# Altium schematic sheet Communication.SchDoc
size A4; Organization: Memristor-Robotics; Address1: Vladimira Perića Valtera; Address2: Novi Sad, 21000; Address3: Serbia; SheetNumber: 7; SheetTotal: 11
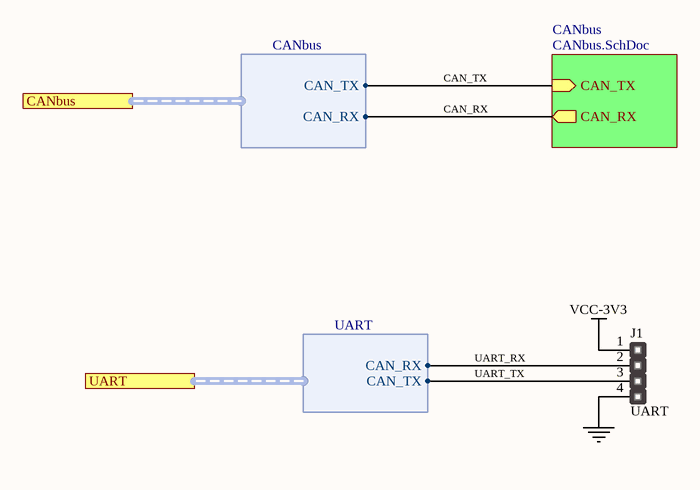
[diagram p0: Communication.SchDoc]

## Parts
J1  UART  [HM1X4]

## Sub-sheets
CANbus = CANbus.SchDoc: CAN_TX (in), CAN_RX (out)

## Ports
CANbus (harness CANbus), UART (harness UART)

## Harnesses
CANbus: CAN_TX, CAN_RX
UART: CAN_TX, CAN_RX

## Nets
GND: J1.4
VCC-3V3: J1.1
CAN_RX: sheet CANbus/CAN_RX, port CANbus.CAN_RX
CAN_TX: sheet CANbus/CAN_TX, port CANbus.CAN_TX
UART_RX: J1.2 ; port UART.CAN_RX
UART_TX: J1.3 ; port UART.CAN_TX

## Notes on the sheet
- Title
- Date:
- Design Engineer:
- Time:
- Revision:
- Sheet
- of
- Size:
- A4
- www.memristor-robotics.io
- File:

## Library data of the parts
J1 = HEADER_1x4